# Altium schematic sheet USB.SchDoc: CATS Telemetry
size A4; Author: Luca Jost; Revision: 1.0; SheetNumber: 1; SheetTotal: 1; Subtitle: USB
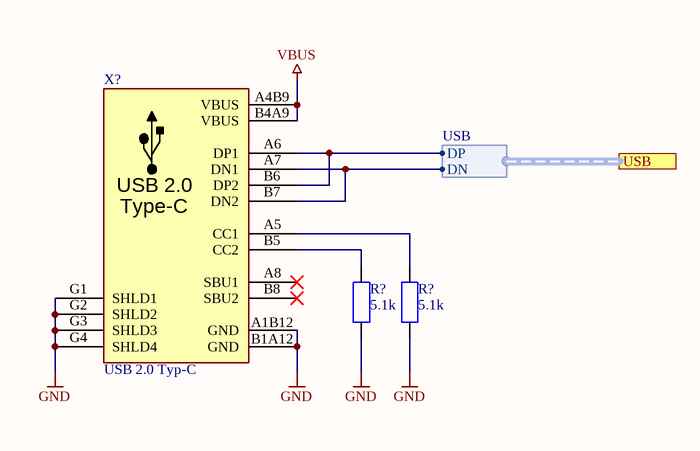
[diagram p0: USB.SchDoc]

## Parts
(Parts that share a designator on the sheet are numbered #1, #2 ... from top to bottom, then left to right.)
R?#1  5.1k  [SMD Widerstand 0603]
R?#2  5.1k  [SMD Widerstand 0603]
X?  USB 2.0 Typ-C  [THT USB-C Socket (A40-00119)]

## Ports
USB (harness USB)

## Harnesses
USB: DP, DN

## Nets
GND: R?#1.1 R?#2.1 X?.A1B12(GND) X?.B1A12(GND) X?.G1(SHLD1) X?.G2(SHLD2) X?.G3(SHLD3) X?.G4(SHLD4)
VBUS: X?.A4B9(VBUS) X?.B4A9(VBUS)
NetR?#1_2: R?#1.2 X?.B5(CC2)
NetR?#2_2: R?#2.2 X?.A5(CC1)
NetX?_A6: X?.A6(DP1) X?.B6(DP2) ; port USB.DP
NetX?_A7: X?.A7(DN1) X?.B7(DN2) ; port USB.DN

Not connected (* = marked no-connect by the designer): X? A8(SBU1)* B8(SBU2)*

## Notes on the sheet
- Title
- Author:
- Subtitle
- Date:
- Rev:
- CATS
- Sheet
- of
- File:
- (in symbol USB Type-C USB 2.0) USB 2.0; Type-C

## Library data of the parts
R?#1 R?#2 = E24 - 5.1k: SMD Chip Resistor E24; Unit Price: 0.01; Number: -; Supplier: -
X? = USB Type-C USB 2.0: Typ-C; aliExpress: 33045191307; Digikey: 2073-USB4105-GF-ACT-ND; Farnell: 3583366